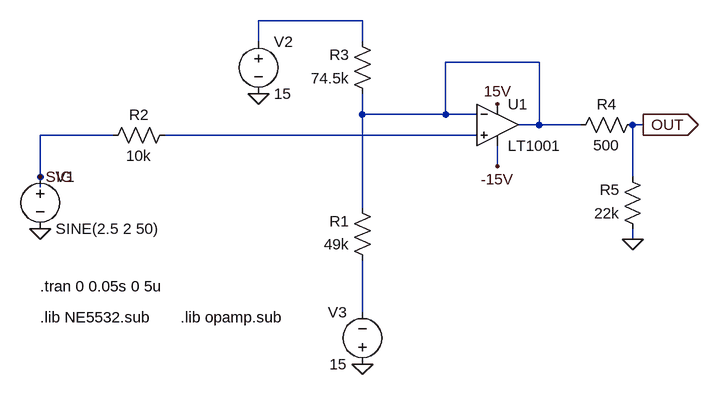
[diagram p0: schematic SPICE_current_sensor_scaling.asc]
SPICE_current_sensor_scaling.asc, the LTspice schematic file:
Version 4
SHEET 1 880 680
WIRE 160 -64 0 -64
WIRE 0 -32 0 -64
WIRE 160 -32 160 -64
WIRE 432 0 288 0
WIRE 160 80 160 48
WIRE 288 80 288 0
WIRE 288 80 160 80
WIRE 336 80 288 80
WIRE 432 96 432 0
WIRE 432 96 400 96
WIRE 496 96 432 96
WIRE 592 96 576 96
WIRE -224 112 -336 112
WIRE 336 112 -144 112
WIRE 368 160 368 128
WIRE -336 176 -336 112
WIRE 576 176 576 96
WIRE -336 192 -336 176
WIRE 160 224 160 80
WIRE 576 272 576 256
WIRE 160 384 160 304
FLAG -336 256 0
FLAG 368 64 15V
FLAG 0 48 0
FLAG 160 464 0
FLAG 368 160 -15V
FLAG 592 96 OUT
IOPIN 592 96 Out
FLAG -336 176 SIG
FLAG 576 272 0
SYMBOL voltage -336 160 R0
SYMATTR InstName V1
SYMATTR Value SINE(2.5 2 50)
SYMATTR SpiceLine Rser=0
SYMBOL voltage 0 -48 R0
SYMATTR InstName V2
SYMATTR Value 15
SYMBOL voltage 160 480 R180
WINDOW 0 24 96 Left 2
WINDOW 3 24 16 Left 2
SYMATTR InstName V3
SYMATTR Value 15
SYMBOL res 176 64 R180
WINDOW 0 36 76 Left 2
WINDOW 3 36 40 Left 2
SYMATTR InstName R3
SYMATTR Value 74.5k
SYMBOL Opamps/LT1001 368 32 R0
SYMATTR InstName U1
SYMBOL res 176 320 R180
WINDOW 0 36 76 Left 2
WINDOW 3 36 40 Left 2
SYMATTR InstName R1
SYMATTR Value 49k
SYMBOL res -128 96 R90
WINDOW 0 0 56 VBottom 2
WINDOW 3 32 56 VTop 2
SYMATTR InstName R2
SYMATTR Value 10k
SYMBOL res 592 80 R90
WINDOW 0 0 56 VBottom 2
WINDOW 3 32 56 VTop 2
SYMATTR InstName R4
SYMATTR Value 500
SYMBOL res 592 272 R180
WINDOW 0 36 76 Left 2
WINDOW 3 36 40 Left 2
SYMATTR InstName R5
SYMATTR Value 22k
TEXT -336 392 Left 2 !.lib NE5532.sub
TEXT -336 344 Left 2 !.tran 0 0.05s 0 5u
TEXT -120 392 Left 2 !.lib opamp.sub

The netlist it stands for:
* SPICE_current_sensor_scaling.asc
V1 SIG 0 SINE(2.5 2 50) Rser=0
V2 N001 0 15
V3 0 N004 15
R3 N002 N001 74.5k
XU1 N003 N002 15V -15V N002 LT1001  ; pins In+ In- V+ V- OUT
R1 N004 N002 49k
R2 N003 SIG 10k
R4 OUT N002 500
R5 0 OUT 22k
.lib NE5532.sub
.tran 0 0.05s 0 5u
.lib opamp.sub
.lib LTC.lib
.backanno
.end